# EasyEDA schematic EEC Capstone-Bottom Board.json
TITLE: LoRaware: Bottom PCB; REV: 1.0; Date: 2019-08-26; Sheet: 1/1; Drawn By: drodrii; Company: EEC 695, Group 1
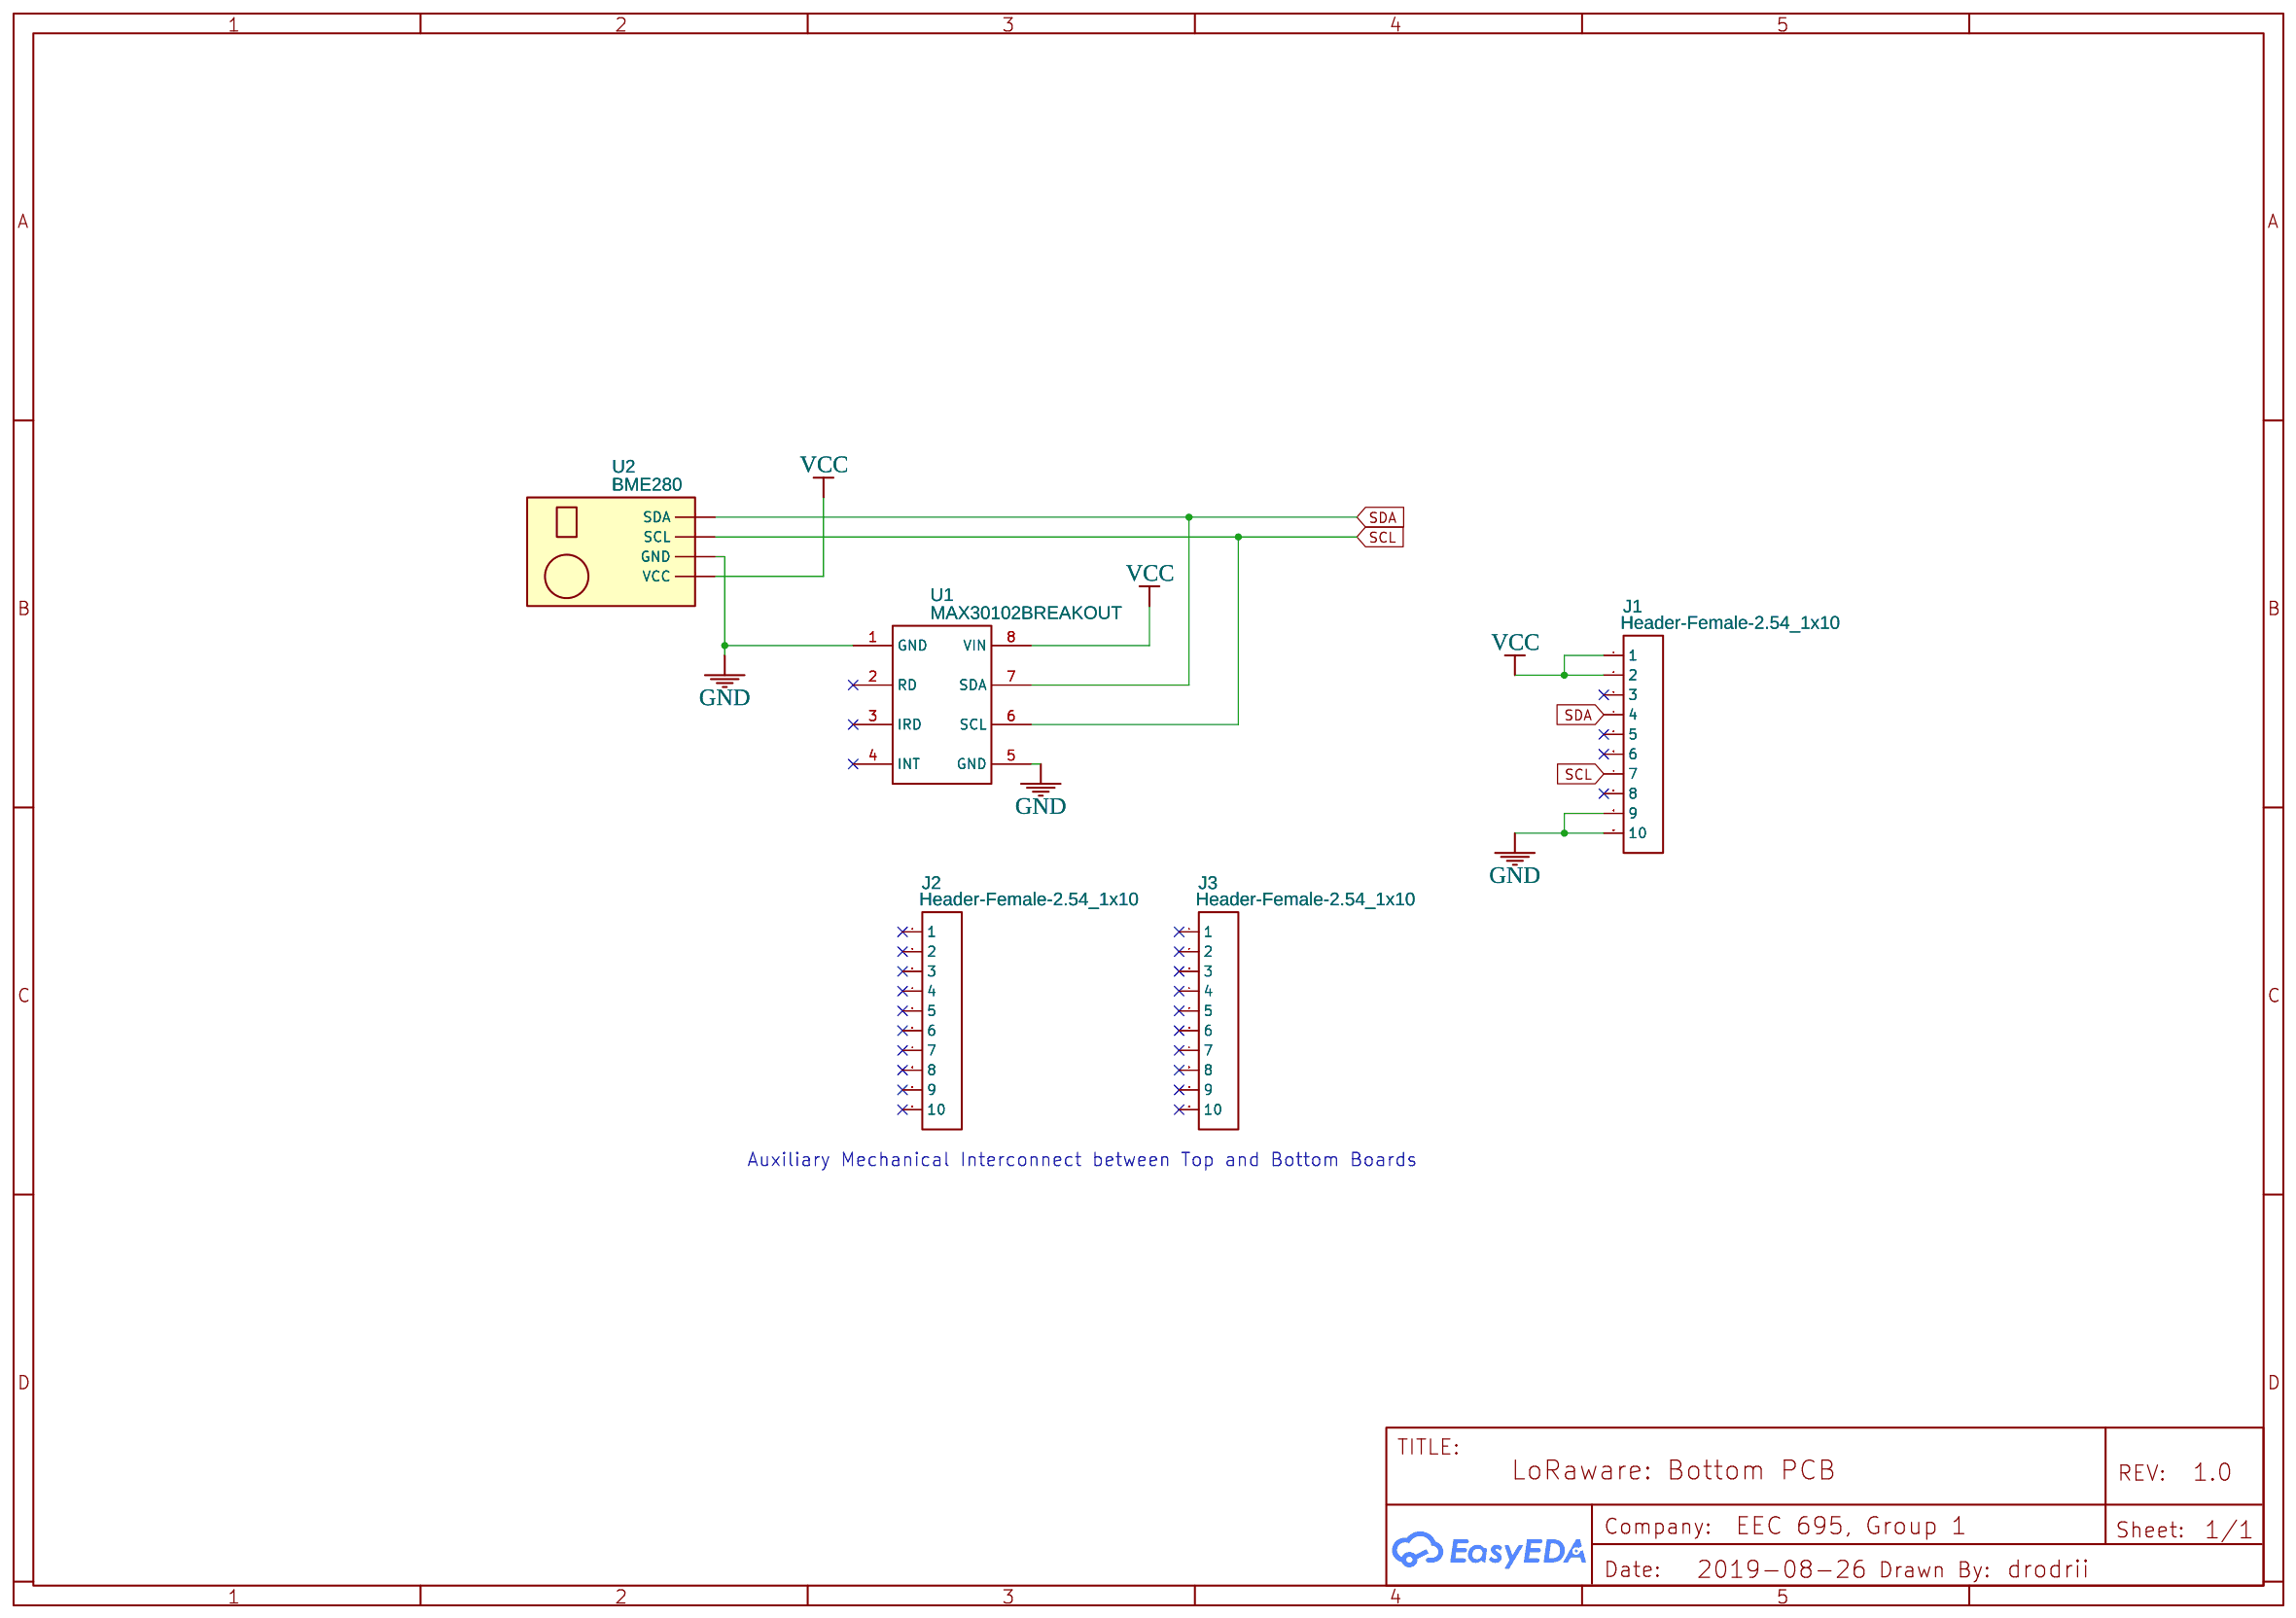
[diagram p0: schematic sheet]

## Parts
J1  Header-Female-2.54_1x10  [HDR-TH_10PIN-V-FEMALE-PITCH2.54]
J2  Header-Female-2.54_1x10  [HDR-TH_10PIN-V-FEMALE-PITCH2.54]
J3  Header-Female-2.54_1x10  [HDR-TH_10PIN-V-FEMALE-PITCH2.54]
U1  MAX30102BREAKOUT  [MAX30102PCB COPY]
U2  BME280  [BME280]

## Library data of the parts
J1-J3 = -: Supplier: LCSC; Manufacturer: BOOMELE; Manufacturer Part: 2.54mm 1*10P Straight Female header Gold-plated; Supplier Part: C35445
U1 = -: Manufacturer Part: MAX30102; Contributor: nickklein95
U2 = -: Contributor: Даниил Баюков (sleepsemek)

## Nets
GND: J1.9 J1.10 U1.1(GND) U1.5(GND) U2.2(GND)
VCC: J1.1 J1.2 U1.8(VIN) U2.1(VCC)
SCL: J1.7 U1.6(SCL) U2.3(SCL)
SDA: J1.4 U1.7(SDA) U2.4(SDA)

Not connected (* = marked no-connect by the designer): J1 3* 5* 6* 8*; J2 1* 2* 3* 4* 5* 6* 7* 8* 9* 10*; J3 1* 2* 3* 4* 5* 6* 7* 8* 9* 10*; U1 2(RD)* 3(IRD)* 4(INT)*

## Notes on the sheet
- Auxiliary Mechanical Interconnect between Top and Bottom Boards
